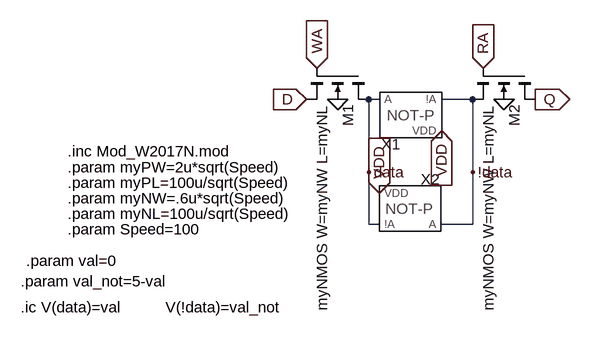
[diagram p0: schematic 6TSRAM.asc]
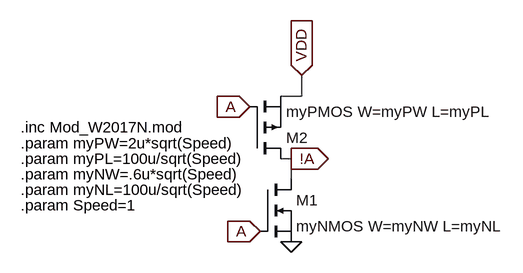
[diagram p1: sub-circuit gate_not_param.asc]
6TSRAM.asc, the LTspice schematic file:
Version 4
SHEET 1 880 680
WIRE 16 -64 0 -64
WIRE 160 -64 112 -64
WIRE 0 48 0 -64
WIRE 160 48 160 -64
WIRE 0 128 0 48
WIRE 16 128 0 128
WIRE 160 128 160 48
WIRE 160 128 112 128
FLAG 112 -16 VDD
IOPIN 112 -16 In
FLAG 16 80 VDD
IOPIN 16 80 In
FLAG 256 -64 Q
IOPIN 256 -64 Out
FLAG 208 -64 0
FLAG -48 -64 0
FLAG -80 -112 WA
IOPIN -80 -112 In
FLAG 176 -112 RA
IOPIN 176 -112 In
FLAG -96 -64 D
IOPIN -96 -64 In
FLAG 0 48 data
FLAG 160 48 !data
SYMBOL Gate_NOT_PARAM 64 -32 R0
SYMATTR InstName X1
SYMBOL Gate_NOT_PARAM 64 96 R180
SYMATTR InstName X2
SYMBOL nmos4 0 -112 R90
SYMATTR InstName M1
SYMATTR Value myNMOS W=myNW L=myNL
SYMBOL nmos4 256 -112 R90
SYMATTR InstName M2
SYMATTR Value myNMOS W=myNW L=myNL
TEXT -464 16 Left 2 !.inc Mod_W2017N.mod
TEXT -464 40 Left 2 !.param myPW=2u*sqrt(Speed)
TEXT -464 64 Left 2 !.param myPL=100u/sqrt(Speed)
TEXT -464 88 Left 2 !.param myNW=.6u*sqrt(Speed)
TEXT -464 112 Left 2 !.param myNL=100u/sqrt(Speed)
TEXT -464 136 Left 2 !.param Speed=100
TEXT -536 216 Left 2 !.param val_not=5-val
TEXT -536 256 Left 2 !.ic V(data)=val          V(!data)=val_not
TEXT -528 184 Left 2 !.param val=0

gate_not_param.asc, the sub-circuit schematic file:
Version 4
SHEET 1 880 680
WIRE 64 -112 64 -144
WIRE 64 -112 32 -112
WIRE 48 -16 32 -16
WIRE 48 16 48 -16
FLAG 48 -16 !A
IOPIN 48 -16 Out
FLAG 64 -144 VDD
IOPIN 64 -144 In
FLAG 48 112 0
FLAG 0 96 A
IOPIN 0 96 In
FLAG -16 -96 A
IOPIN -16 -96 In
SYMBOL nmos 0 16 R0
SYMATTR InstName M1
SYMATTR Value myNMOS W=myNW L=myNL
SYMBOL pmos -16 -16 M180
SYMATTR InstName M2
SYMATTR Value myPMOS W=myPW L=myPL
TEXT -368 -64 Left 2 !.inc Mod_W2017N.mod
TEXT -368 -40 Left 2 !.param myPW=2u*sqrt(Speed)
TEXT -368 -16 Left 2 !.param myPL=100u/sqrt(Speed)
TEXT -368 8 Left 2 !.param myNW=.6u*sqrt(Speed)
TEXT -368 32 Left 2 !.param myNL=100u/sqrt(Speed)
TEXT -368 56 Left 2 !.param Speed=1

The netlist it stands for:
* 6TSRAM.asc
XX1 data VDD !data gate_not_param
XX2 !data VDD data gate_not_param
M1 data WA D 0 myNMOS W=myNW L=myNL
M2 Q RA !data 0 myNMOS W=myNW L=myNL

* block symbol definitions
.subckt gate_not_param A VDD !A
M1 !A A 0 0 myNMOS W=myNW L=myNL
M2 !A A VDD VDD myPMOS W=myPW L=myPL
.inc Mod_W2017N.mod
.param myPW=2u*sqrt(Speed)
.param myPL=100u/sqrt(Speed)
.param myNW=.6u*sqrt(Speed)
.param myNL=100u/sqrt(Speed)
.param Speed=1
.ends gate_not_param

.model NMOS NMOS
.model PMOS PMOS
.lib standard.mos
.inc Mod_W2017N.mod
.param myPW=2u*sqrt(Speed)
.param myPL=100u/sqrt(Speed)
.param myNW=.6u*sqrt(Speed)
.param myNL=100u/sqrt(Speed)
.param Speed=100
.param val_not=5-val
.ic V(data)=val          V(!data)=val_not
.param val=0
.backanno
.end